# EasyEDA Pro project 成图电子类竞赛_嘉立创v2.epro

# Schematic 成图电子类竞赛

## Sheets
1 02-CPU
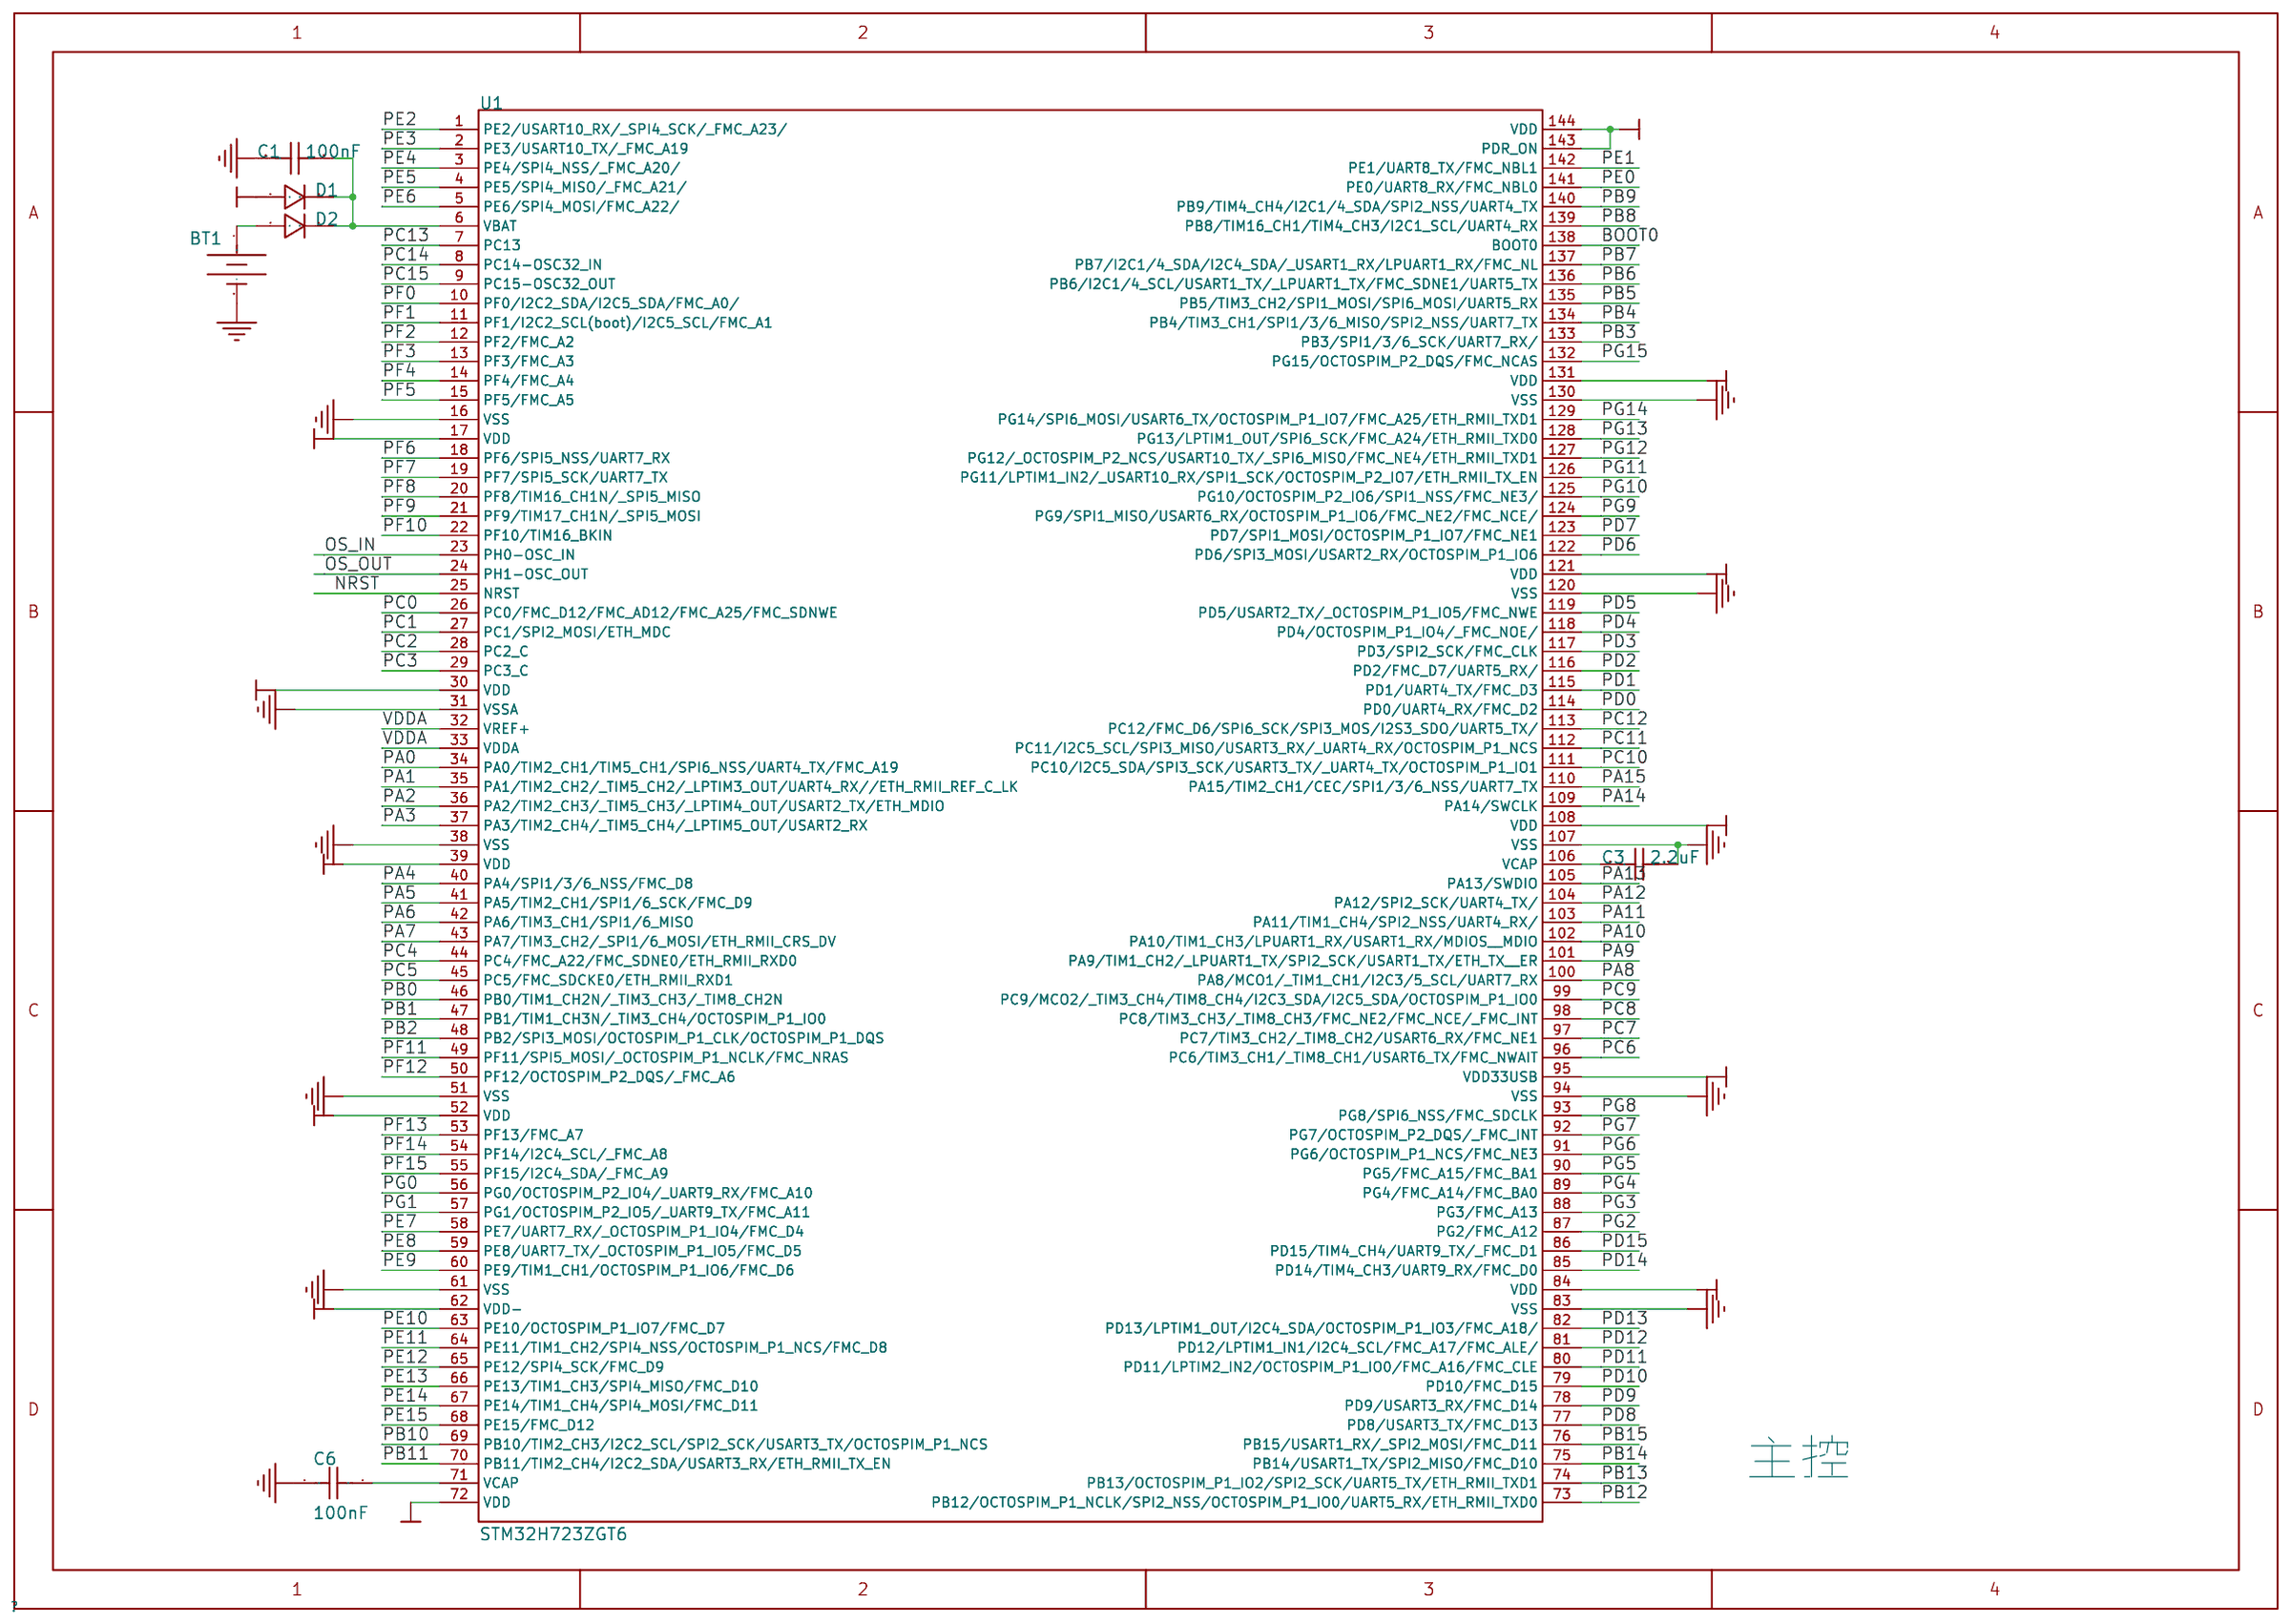
[diagram p0: 02-CPU]
2 04-USB-TFT
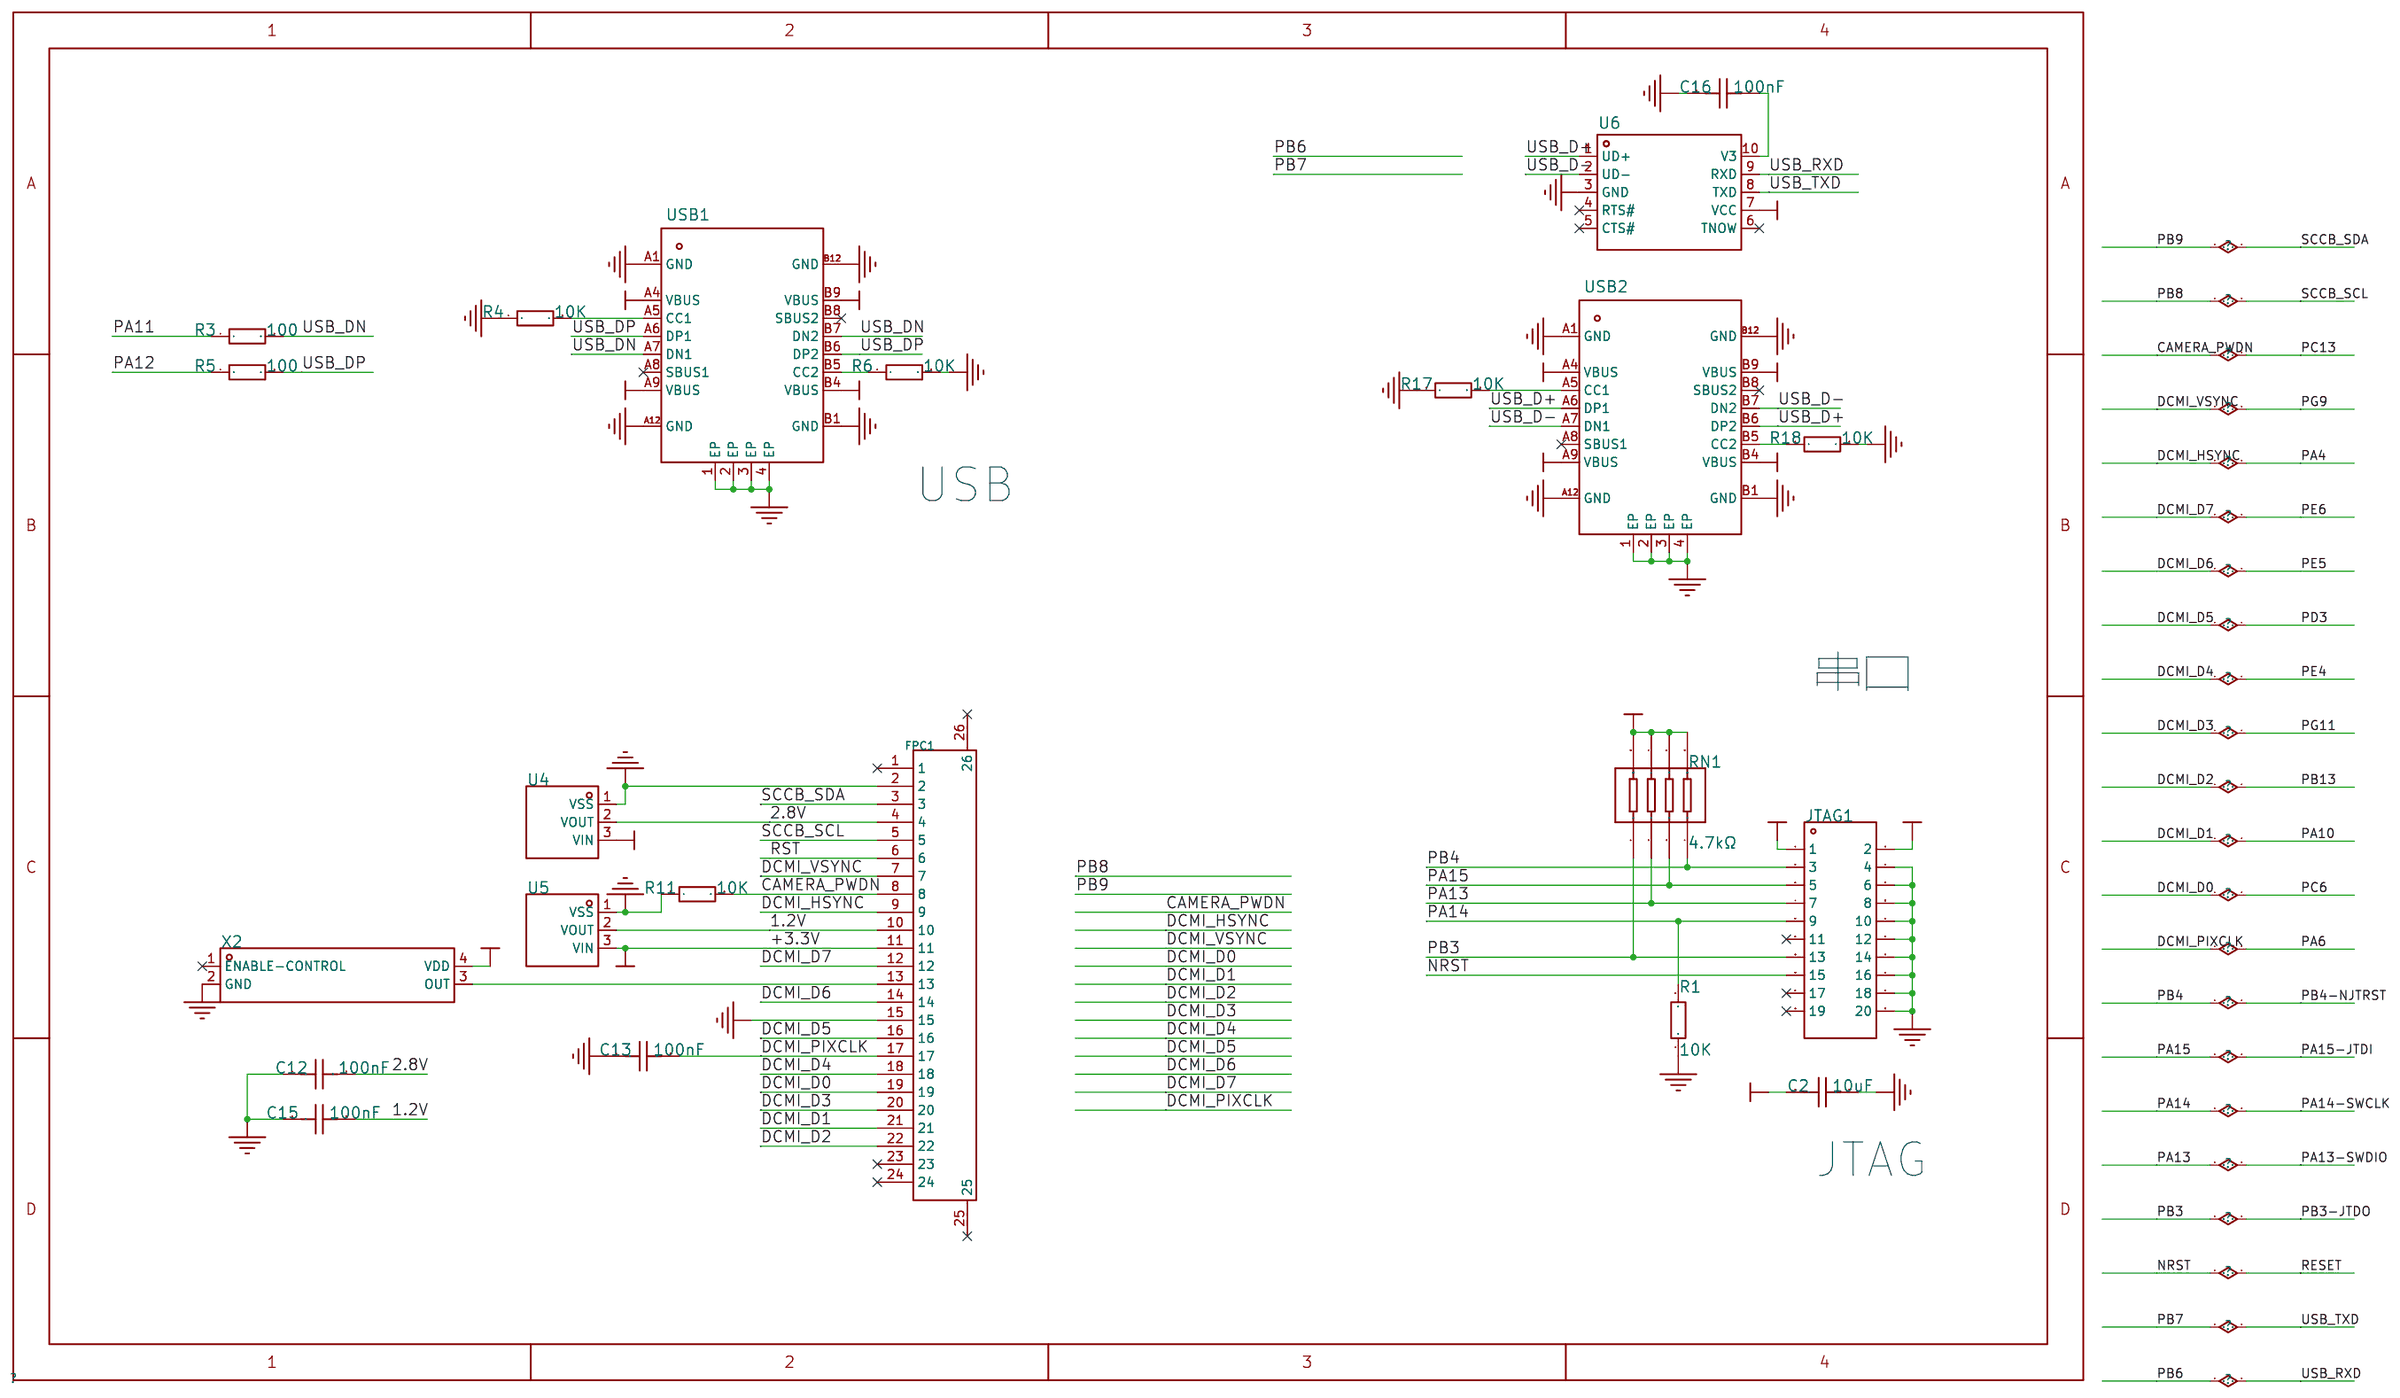
[diagram p1: 04-USB-TFT]
3 01-POWER
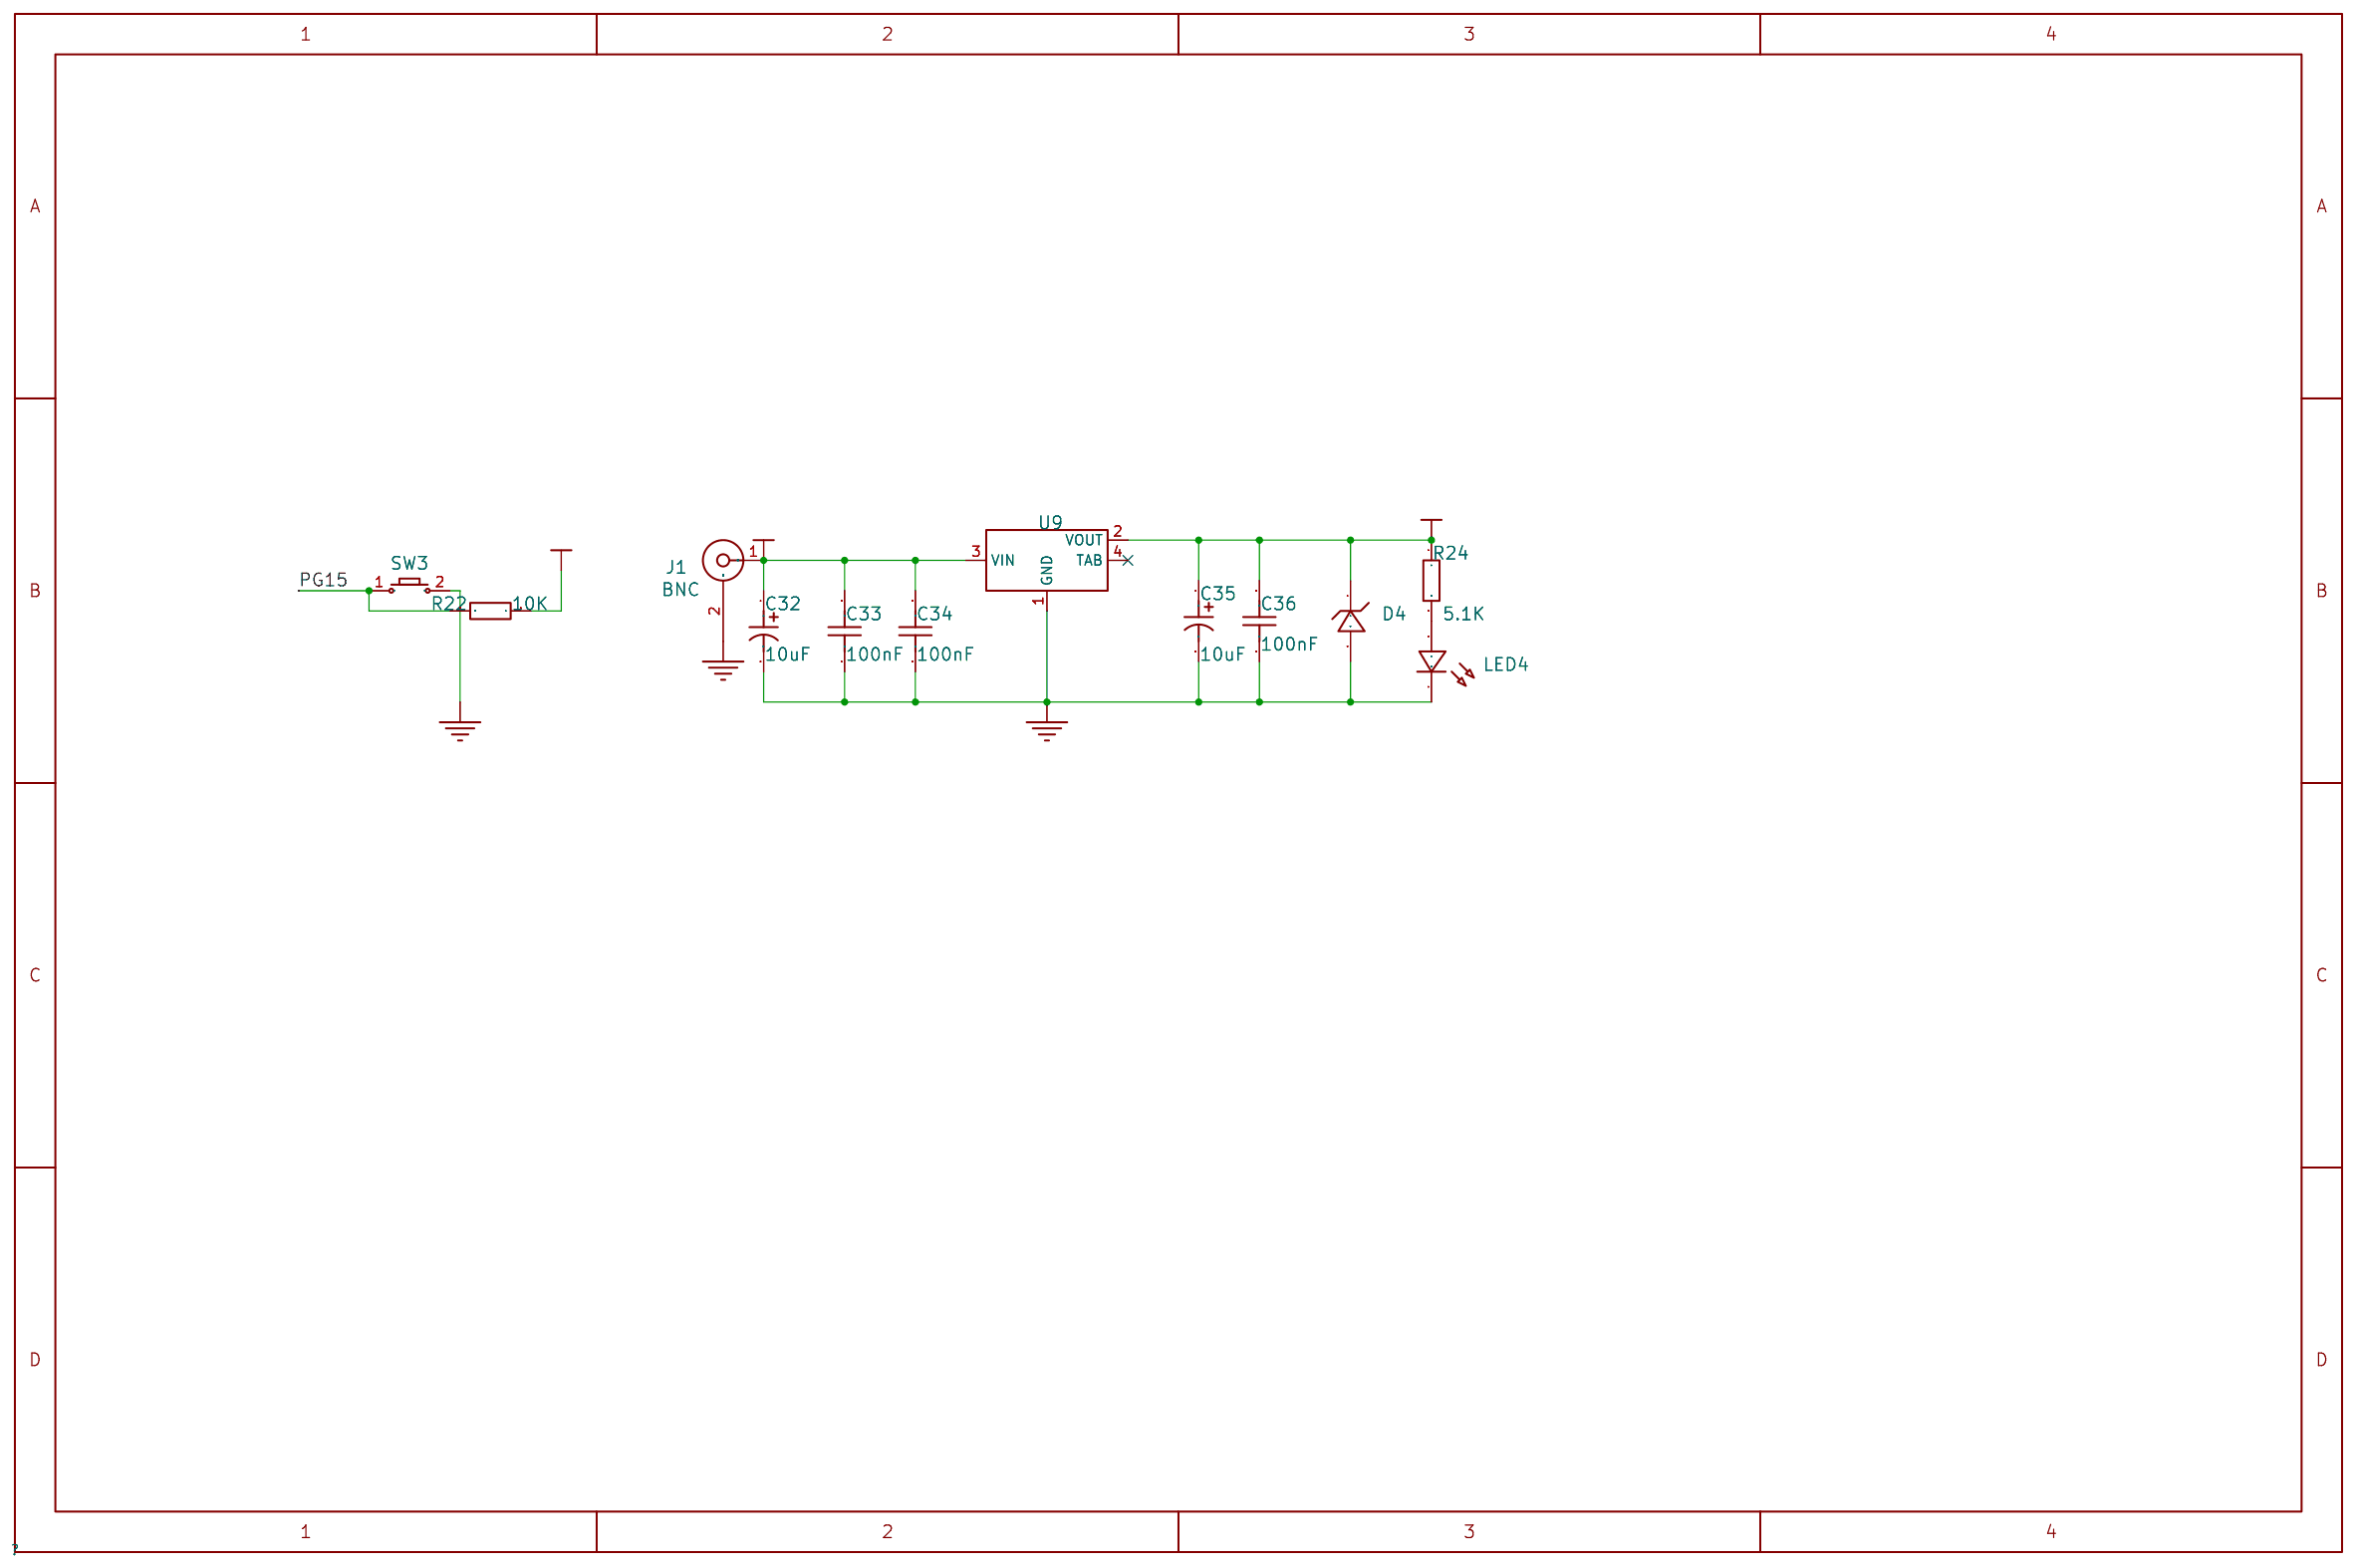
[diagram p2: 01-POWER]
4 03-SROM
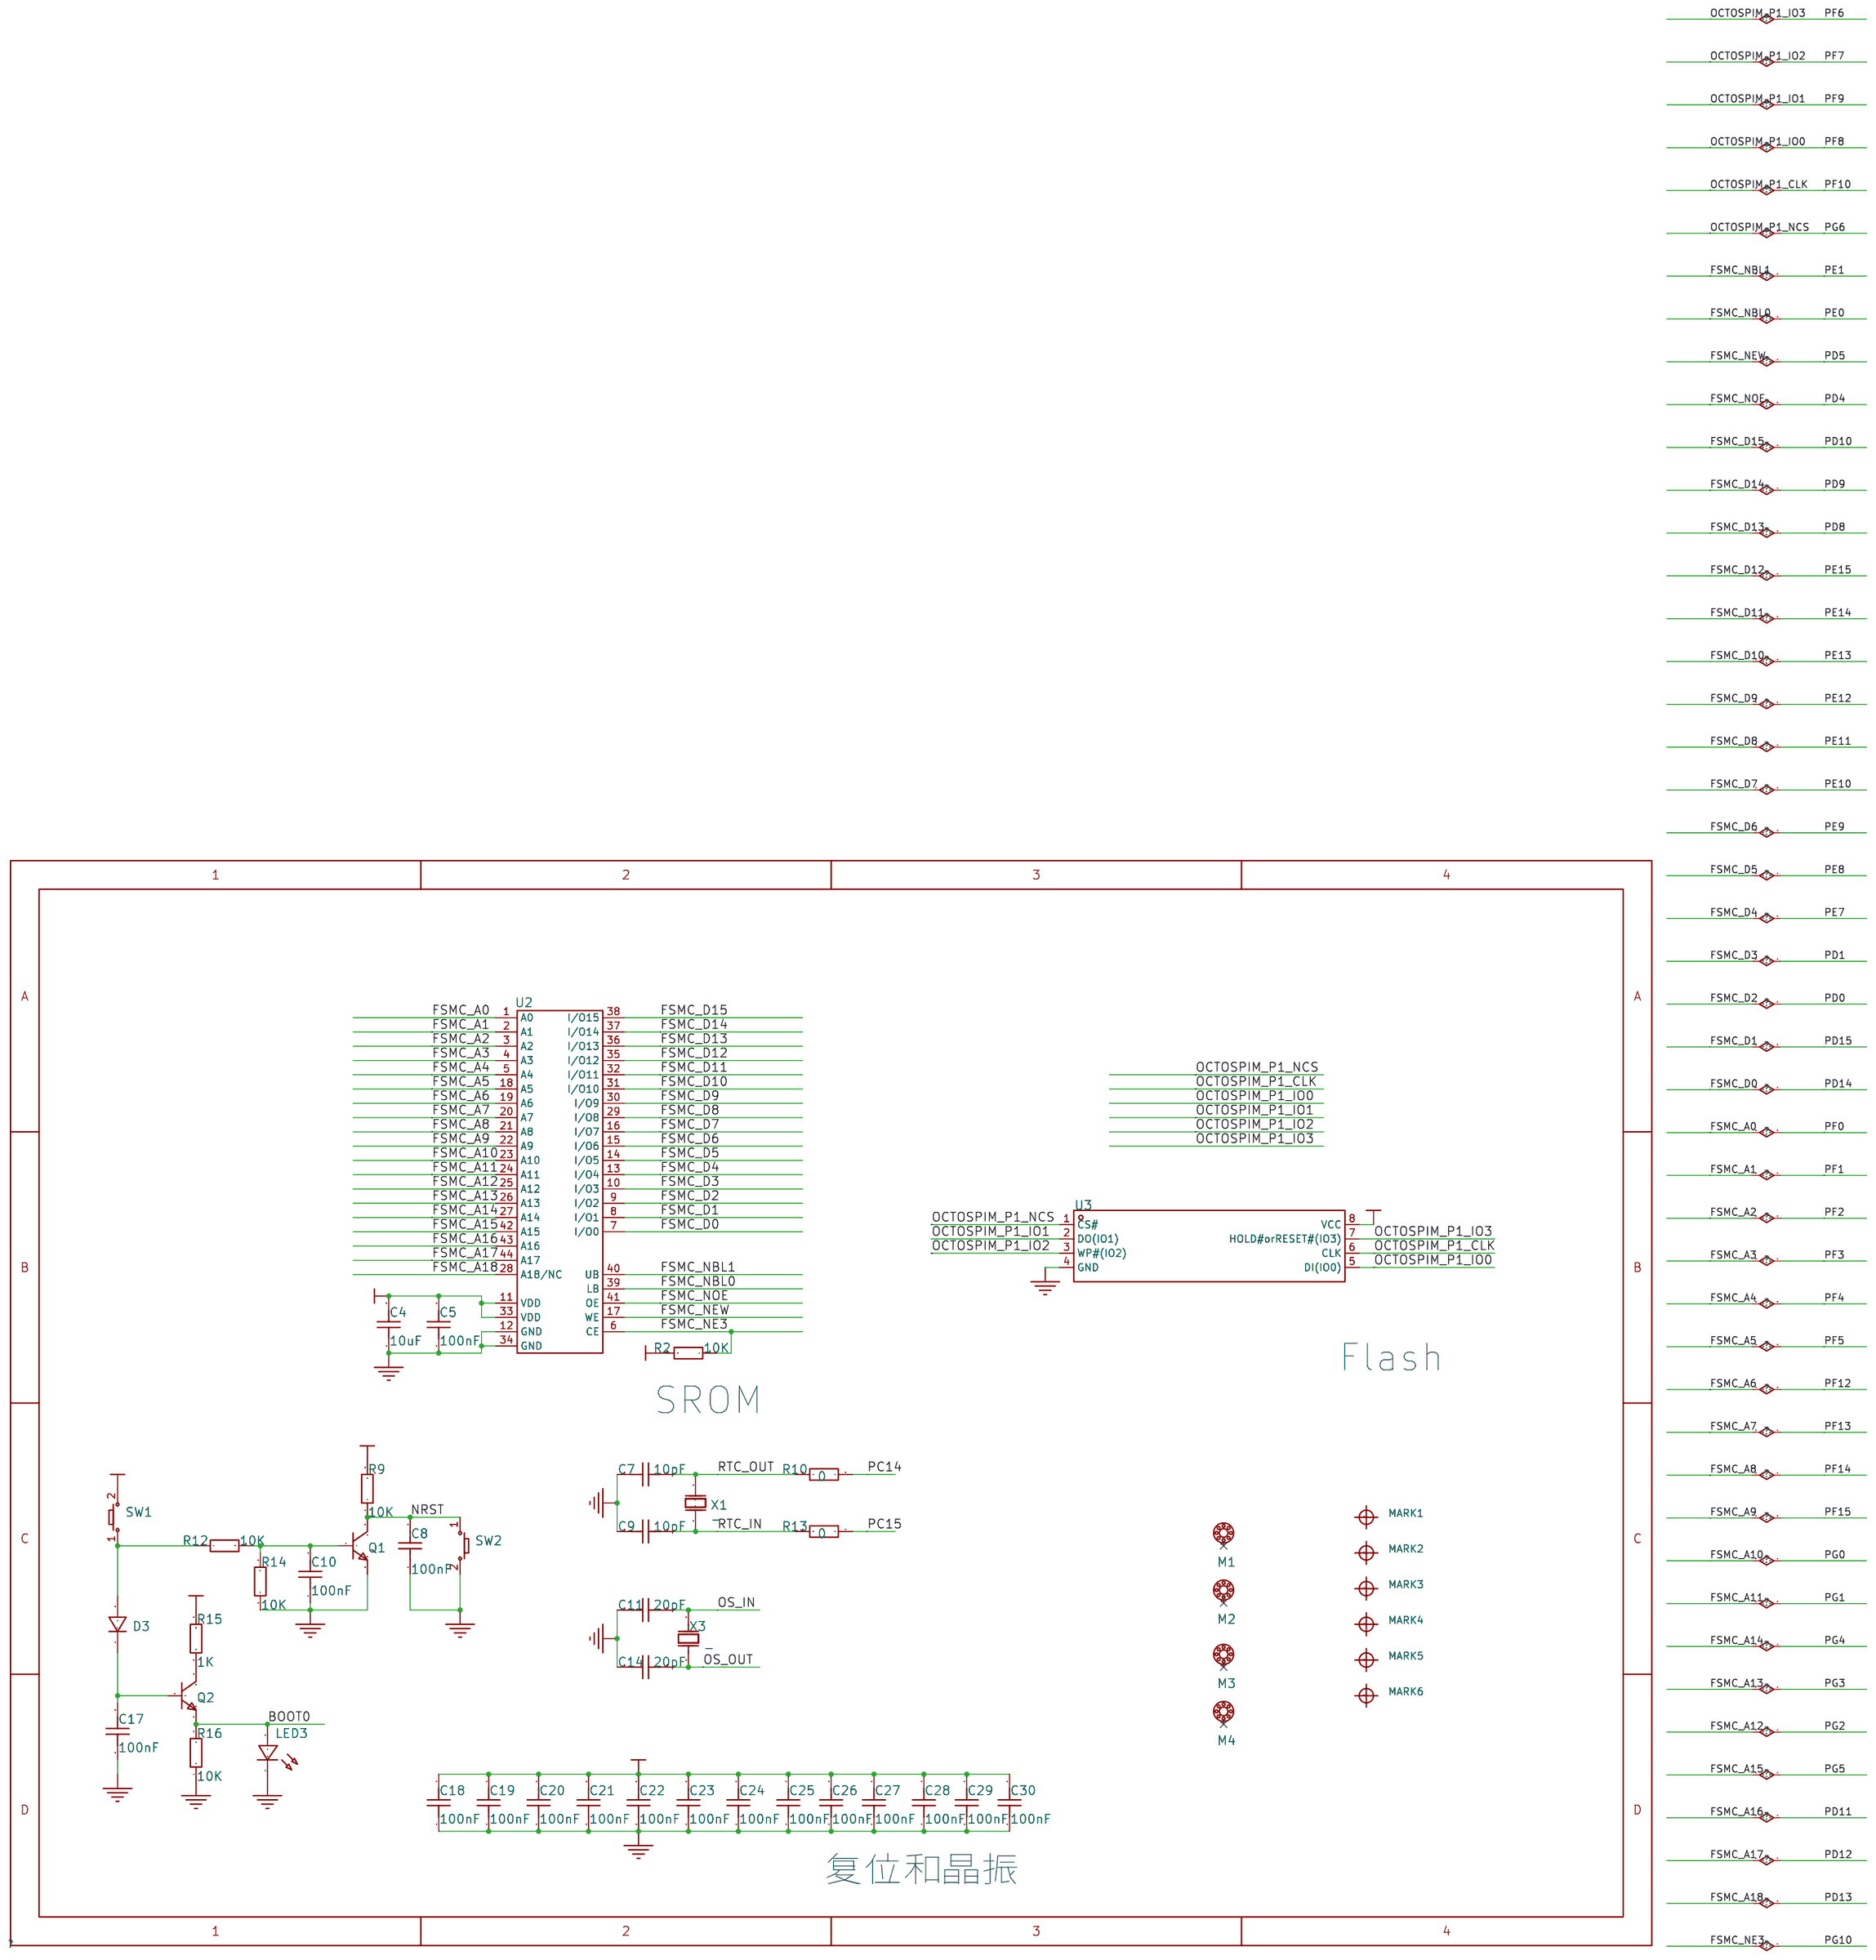
[diagram p3: 03-SROM]

## Parts
sheet 01-POWER
C32  10uF  [CAP-SMD_L3.5-W2.8]
C33  100nF  [C0603]
C34  100nF  [C0603]
C35  10uF  [CAP-SMD_L3.5-W2.8]
C36  100nF  [C0603]
D4  SMBJ3.3A_C362089  [SMB_L4.6-W3.6-LS5.3-RD]
J1  BNC  [DC-005B]
LED4  LED_0603-R  [LED_0603]
R22  10K  [R0603]
R24  5.1K  [R0603]
SW3  -  [Key_SMD_3.6x6.1x2.5]
U9  AMS1117  [SOT_223]
sheet 02-CPU
BT1  BS-12-B3AA003  [BAT-SMD_BS-12-B3AA011]
C1  100nF  [C0603]
C3  2.2uF  [C0603]
C6  100nF  [C0603]
D1  LL4148_C9808  [LL-34_L3.5-W1.5-RD]
D2  LL4148_C9808  [LL-34_L3.5-W1.5-RD]
U1  STM32H723ZGT6  [LQFP-144_20.0X20.0X0.5P]
sheet 03-SROM
C4  10uF  [C0603]
C5  100nF  [C0603]
C7  10pF  [C0603]
C8  100nF  [C0603]
C9  10pF  [C0603]
C10  100nF  [C0603]
C11  20pF  [C0603]
C14  20pF  [C0603]
C17  100nF  [C0603]
C18  100nF  [C0603]
C19  100nF  [C0603]
C20  100nF  [C0603]
C21  100nF  [C0603]
C22  100nF  [C0603]
C23  100nF  [C0603]
C24  100nF  [C0603]
C25  100nF  [C0603]
C26  100nF  [C0603]
C27  100nF  [C0603]
C28  100nF  [C0603]
C29  100nF  [C0603]
C30  100nF  [C0603]
D3  LL4148_C9808  [LL-34_L3.5-W1.5-RD]
LED3  LED_0603-R  [LED_0603]
M1  M3螺丝  [Screw]
M2  M3螺丝  [Screw]
M3  M3螺丝  [Screw]
M4  M3螺丝  [Screw]
MARK1  -  [Mark-Point-1mm]  (no BOM)
MARK2  -  [Mark-Point-1mm]  (no BOM)
MARK3  -  [Mark-Point-1mm]  (no BOM)
MARK4  -  [Mark-Point-1mm]  (no BOM)
MARK5  -  [Mark-Point-1mm]  (no BOM)
MARK6  -  [Mark-Point-1mm]  (no BOM)
Q1  S8050_SOT_NPN  [S8050_SOT-23]
Q2  S8050_SOT_NPN  [S8050_SOT-23]
R2  10K  [R0603]
R9  10K  [R0603]
R10  0  [R0402]
R12  10K  [R0603]
R13  0  [R0402]
R14  10K  [R0603]
R15  1K  [R0603]
R16  10K  [R0603]
SW1  -  [Key_SMD_3.6x6.1x2.5]
SW2  -  [Key_SMD_3.6x6.1x2.5]
U2  IS62WV51216  [TSOP-44]
U3  W25Q128JVSIQ_C113767  [SOIC-8_L5.3-W5.3-P1.27-LS8.0-BL]
X1  -  [OSC-TH_BD2.1-P0.70-D0.3]
X3  -  [HC-49S_L11.4-W4.8]
sheet 04-USB-TFT
C2  10uF  [C0603]
C12  100nF  [C0603]
C13  100nF  [C0603]
C15  100nF  [C0603]
C16  100nF  [C0603]
FPC1  AFC01-S24FCA-00  [FPC-SMD_P0.50-24P_FGS-XJ-H2.0]
JTAG1  IDC-20  [IDC-TH_20P-P2.54-V-R2-C10-S2.54]
R1  10K  [R0603]
R3  100  [R0603]
R4  10K  [R0603]
R5  100  [R0603]
R6  10K  [R0603]
R11  10K  [R0603]
R17  10K  [R0603]
R18  10K  [R0603]
RN1  4.7kΩ  [RES-ARRAY-SMD_0603-8P-L3.2-W1.6-BL]
U4  XC6206-2.8V  [SOT-23-3_L2.9-W1.6-P1.90-LS2.8-BR]
U5  XC6206P122MR-G  [SOT-23-3_L2.9-W1.6-P1.90-LS2.8-BR]
U6  CH340E  [MSOP-10_L3.0-W3.0-P0.50-LS5.0-BL]
USB1  USB_TYPE-C-16P  [USB_TYPE-C-16P]
USB2  USB_TYPE-C-16P  [USB_TYPE-C-16P]
X2  12M 有源晶振  [OSC-SMD_4P-L3.2-W2.5-BL]

## Library data of the parts
C32 C35 = CA45-B-16V-4.7μF-K: 容值:4.7uF;精度:±10%;额定电压:16V;等效串联电阻:3.5Ω@100kHz;; LCSC Part Name: 4.7uF ±10% 16V; Manufacturer: TORCH(火炬); Supplier Footprint: 1210; JLCPCB Part Class: Extended Part; Datasheet: https://atta.szlcsc.com/upload/public/pdf/source/20191009/C435293_78A410F3D73489DBEAC46056C4262F7A.pdf; Supplier: LCSC; Tolerance: ±10%; Rated Voltage: 16V; Equivalent Series Resistance(ESR): 3.5Ω@100kHz; Operating Temperature: -55℃~+125℃
C1-C30 C33 C34 C36 = CAP_0603: Supplier Footprint: 0603
D4 = SMBJ3.3A_C362089: 反向截止电压(Vrwm):3.3V;击穿电压:4.1V;最大钳位电压:7.3V;; LCSC Part Name: 单向TVS 3.3V截止 600W峰值脉冲功率; Supplier Part: C362089; Manufacturer: JKSEMI(金开盛); Manufacturer Part: SMBJ3.3A; Supplier Footprint: SMB(DO-214AA); JLCPCB Part Class: Extended Part; Datasheet: https://atta.szlcsc.com/upload/public/pdf/source/20200731/C362089_3B984BF84356FE4A5051ADB3F5B1E766.pdf; Supplier: LCSC; Unidirectional Channels: 1; Bidirectional Channels: 0; Reverse Stand-Off Voltage (Vrwm): 3.3V; Breakdown Voltage: 4.1V; Maximum Clamping Voltage: 7.3V; Peak Pulse Power Dissipation (Ppp)@10/1000us: 600W
J1 = BNC: PCB DECAL: RCA-101; SOURCE_PATH: C:\PROGRAM FILES\印院出品\CAPTURE 16.2\LIBRARY\CONNECTOR.OLB; LibraryName: VIDEO_Demo_Kit_1
LED3 LED4 = LED_0603: Supplier Footprint: 0603
R2-R6 R11 R12 R17 R18 R22 = Res_0603_1: Supplier Footprint: 0603; DesignItemID: Res_0603
R1 R9 R14-R16 R24 = Res_0603: Supplier Footprint: 0603
SW3 = Key_SMD_3.6x6.1x2.5: Supplier Footprint: SMD
U9 = AMS1117
BT1 = BS-12-B3AA003: 连接器类型:电池底座;适用电池规格:CR1220;工作温度范围:-25℃~+85℃;; Supplier: LCSC; Supplier Part: C964723; Manufacturer: MYOUNG(美阳); JLCPCB Part Class: 扩展库; LCSC Part Name: 电池底座 适用电池:CR1220; Supplier Footprint: SMD; Datasheet: https://atta.szlcsc.com/upload/public/pdf/source/20201218/C964723_733B638E287393F86295A2A4DAE43C75.pdf; Connector Type: 电池底座; Battery Type: CR1220; Operating Temperature Range: -25℃~+85℃
D1-D3 = LL4148_C9808: 二极管配置:-;功率:500mW;直流反向耐压(Vr):75V;平均整流电流(Io):200mA;正向压降(Vf):1V@10mA;反向电流(Ir):5uA@75V;反向恢复时间(trr):4ns;工作温度:+175℃@(Tj);; LCSC Part Name: 75V 200mA 4ns; Supplier Part: C9808; Manufacturer: ST(先科); Manufacturer Part: LL4148; Supplier Footprint: LL-34; JLCPCB Part Class: Basic Part; Datasheet: https://atta.szlcsc.com/upload/public/pdf/source/20121108/1457706554347.pdf; Supplier: LCSC; Power Dissipation: 500mW; Reverse Voltage (Vr): 75V; Average Rectified Current (Io): 200mA; Forward Voltage (Vf@If): 1V@10mA; Reverse Leakage Current: 5uA@75V; Reverse Recovery Time (trr): 4ns; Operating Temperature: +175℃@(Tj)
U1 = STM32H723ZGT6: ARM-M系列 CPU最大主频：550MHz 程序存储容量：1MB 程序存储器类型：FLASH RAM总容量：564KB GPIO端口数量：80
M1-M4 = M3螺丝: Pin Type: IN
MARK1-MARK6 = Mark-Point: Mark点
Q1 Q2 = S8050_SOT_NPN: Supplier Footprint: SOT-23
R10 R13 = Res_0402: Supplier Footprint: 0402
SW1 SW2 = Key_SMD_3.6x6.1x2.5_1: Supplier Footprint: SMD
U2 = IS62WV51216: Pin Type: IN
U3 = W25Q128JVSIQ_C113767: LCSC Part Name: W25Q128JVSIQ; Supplier Part: C113767; Manufacturer: WINBOND(华邦); Manufacturer Part: W25Q128JVSIQ; Supplier Footprint: SOIC-8-208mil; JLCPCB Part Class: 扩展库; Datasheet: https://atta.szlcsc.com/upload/public/pdf/source/20180329/C113767_097B64D788F6E3FFB2E9CB46CB6C1427.pdf; Supplier: LCSC
X1 = 1TD125BFNS001: 频率:-;负载电容:-;; LCSC Part Name: DT-26 32.768K 10PPM 12.5PF 袋装/盒装 袋装/盒装; Supplier Part: C213419; Manufacturer: KDS(大真空); Supplier Footprint: DT-26; JLCPCB Part Class: 扩展库; Datasheet: https://atta.szlcsc.com/upload/public/pdf/source/20180530/C213419_C8E01C2F1F46F9420141CAE391D7F4A5.pdf; Supplier: LCSC
X3 = 9C08000003: 频率:-;负载电容:-;; LCSC Part Name: HC-49SMD 8M 20pF 20ppm; Supplier Part: C90937; Manufacturer: TXC(晶技); Supplier Footprint: HC-49S-SMD; JLCPCB Part Class: Extended Part; Datasheet: https://atta.szlcsc.com/upload/public/pdf/source/20161217/1481939207740.pdf; Supplier: LCSC
FPC1 = AFC01-S24FCA-00: 间距:0.5mm;触点数量:24P;锁定特性:翻盖式;安装类型:卧贴;触点类型:下接;; Supplier: LCSC; Supplier Part: C262669; Manufacturer: JS(钜硕电子); JLCPCB Part Class: 扩展库; LCSC Part Name: 0.5mm P数:24P 翻盖式 下接; Supplier Footprint: SMD,P=0.5mm; Datasheet: https://atta.szlcsc.com/upload/public/pdf/source/20190816/C413942_2A72D1AC756EAE17EEDF756A339D4500.pdf; Pitch: 0.5mm; Number of Contacts: 24P; Locking Feature: 翻盖式; Mounting Type: 卧贴; Contact Type: 下接; Height Above Board: 2mm; FFC, FCB Thickness: 0.3mm
JTAG1 = IDC-20: Supplier Part: C9900015890; Supplier Footprint: JTAG; JLCPCB Part Class: ExtendedPart; Datasheet: https://atta.szlcsc.comnull; Supplier: LCSC
RN1 = 4D03WGJ0472T5E: 阻值:4.7kΩ;精度:±5%;单个元件功率:62.5mW;电阻器数:4;温度系数:±200ppm/℃;; Supplier: LCSC; Manufacturer: UNI-ROYAL(厚声); Supplier Part: C1980; JLCPCB Part Class: 基础库; LCSC Part Name: 4.7kΩ ±5%; Supplier Footprint: 0603x4; Datasheet: https://atta.szlcsc.com/upload/public/pdf/source/20191224/C474318_2527498AE30E813171187CCD28401A71.pdf; Tolerance: ±5%; Power(Watts): 62.5mW; Number of Resistors: 4; Number of Pins: 8; Temperature Coefficient: ±200ppm/℃
U4 = XC6206-2.8V: 输出类型:固定;输出极性:正;最大输入电压:6V;输出电压:2.8V;输出电流:250mA;; Supplier Part: C2892669; Manufacturer: YONGYUTAI(永裕泰); Supplier Footprint: SOT-23-3L; JLCPCB Part Class: 扩展库; Datasheet: https://atta.szlcsc.com/upload/public/pdf/source/20210901/DE3C77F0CE73FFE8F7C655BE9B94CB06.pdf; Supplier: LCSC; Output Type: 固定; Output Polarity: 正; Number of Outputs: 1; Maximum Input Voltage: 6V; Output Voltage: 2.8V; Output Current: 250mA; Operating Temperature: -40℃~+85℃@(Tj)
U5 = XC6206P122MR-G: 输出类型:固定;输出极性:正;最大输入电压:7V;输出电压:1.2V~1.2V;输出电流:60mA;电源纹波抑制比(PSRR):-;; Supplier Part: C424699; Manufacturer: TOREX(特瑞仕); Supplier Footprint: SOT-23; JLCPCB Part Class: 扩展库; Datasheet: https://atta.szlcsc.com/upload/public/pdf/source/20190903/C424699_59FCC169C113A8B3272904318A708AFC.pdf; Supplier: LCSC; Output Type: 固定; Output Polarity: 正; Number of Outputs: 1; Maximum Input Voltage: 7V; Output Voltage: 1.2V~1.2V; Dropout Voltage: 960mV@(60mA); Output Current: 60mA
U6 = CH340E: 应用功能:收发器;接口协议:USB 2.0;数据速率:2Mbps;; Supplier: LCSC; Manufacturer: WCH(南京沁恒); Supplier Part: C99652; JLCPCB Part Class: 扩展库; LCSC Part Name: USB转串口芯片 CH340; Supplier Footprint: MSOP-10; Datasheet: https://atta.szlcsc.com/upload/public/pdf/source/20230530/6E401E9554E9F5311886CC8B3F89B62E.pdf; Applications Function: 收发器; Protocol: USB 2.0; Data Rate: 2Mbps; Supply Voltage: 3.3V；5V
USB1 USB2 = USB_TYPE-C-16P: Supplier Footprint: SMD
X2 = 12M 有源晶振: Supplier Part: C9900018362; Supplier Footprint: SMD3225; JLCPCB Part Class: 扩展库; Datasheet: https://atta.szlcsc.comnull; Supplier: LCSC

## Nets
1.2V: C15.2 FPC1.10 U5.2(VOUT)
2.8V: C12.2 FPC1.4 U4.2(VOUT)
+3.3V: C2.1 C4.2 C5.2 C18.2 C19.2 C20.2 C21.2 C22.2 C23.2 C24.2 C25.2 C26.2 C27.2 C28.2 C29.2 C30.2 C35.1 C36.2 D1.2(A) D4.1 FPC1.11 JTAG1.1 JTAG1.2 R2.2 R9.2 R15.2 R22.1 R24.1 RN1.5 RN1.6 RN1.7 RN1.8 SW1.2 U1.17(VDD) U1.30(VDD) U1.39(VDD) U1.52(VDD) U1.62(VDD-) U1.72(VDD) U1.84(VDD) U1.95(VDD33USB) U1.108(VDD) U1.121(VDD) U1.131(VDD) U1.143(PDR_ON) U1.144(VDD) U2.11(VDD) U2.33(VDD) U3.8(VCC) U4.3(VIN) U5.3(VIN) U9.2(VOUT) X2.4(VDD)
+5V: C32.1 C33.2 C34.2 J1.1(CENTER) U6.7(VCC) U9.3(VIN) USB1.A4(VBUS) USB1.A9(VBUS) USB1.B4(VBUS) USB1.B9(VBUS) USB2.A4(VBUS) USB2.A9(VBUS) USB2.B4(VBUS) USB2.B9(VBUS)
GND: BT1.2(-) C1.2 C2.2 C3.1 C4.1 C5.1 C6.1 C7.1 C8.1 C9.1 C10.1 C11.1 C12.1 C13.1 C14.1 C15.1 C16.2 C17.1 C18.1 C19.1 C20.1 C21.1 C22.1 C23.1 C24.1 C25.1 C26.1 C27.1 C28.1 C29.1 C30.1 C32.2 C33.1 C34.1 C35.2 C36.1 D4.2 FPC1.2 FPC1.15 J1.2(SHIELD) JTAG1.4 JTAG1.6 JTAG1.8 JTAG1.10 JTAG1.12 JTAG1.14 JTAG1.16 JTAG1.18 JTAG1.20 LED3.1(C) LED4.1(C) Q1.2 R1.1 R4.1 R6.2 R11.1 R14.1 R16.1 R17.1 R18.2 SW2.2 SW3.2 U1.16(VSS) U1.31(VSSA) U1.38(VSS) U1.51(VSS) U1.61(VSS) U1.83(VSS) U1.94(VSS) U1.107(VSS) U1.120(VSS) U1.130(VSS) U2.12(GND) U2.34(GND) U3.4(GND) U4.1(VSS) U5.1(VSS) U6.3(GND) U9.1(GND) USB1.1(EP) USB1.2(EP) USB1.3(EP) USB1.4(EP) USB1.A1(GND) USB1.A12(GND) USB1.B1(GND) USB1.B12(GND) USB2.1(EP) USB2.2(EP) USB2.3(EP) USB2.4(EP) USB2.A1(GND) USB2.A12(GND) USB2.B1(GND) USB2.B12(GND) X2.2(GND)
VDDA: U1.32(VREF+) U1.33(VDDA)
BOOT0: LED3.2(A) Q2.2 R16.2 U1.138(BOOT0)
CAMERA_PWDN: FPC1.8 R11.2 U1.7(PC13)
DCMI_D0: FPC1.19 U1.96(PC6/TIM3_CH1/ TIM8_CH1/USART6_TX/FMC_NWAIT)
DCMI_D1: FPC1.21 U1.102(PA10/TIM1_CH3/LPUART1_RX/USART1_RX/MDIOS_ MDIO)
DCMI_D2: FPC1.22 U1.74(PB13/OCTOSPIM_P1_IO2/SPI2_SCK/UART5_TX/ETH_RMII_TXD1)
DCMI_D3: FPC1.20 U1.126(PG11/LPTIM1_IN2/ USART10_RX/SPI1_SCK/OCTOSPIM_P2_IO7/ETH_RMII_TX_EN)
DCMI_D4: FPC1.18 U1.3(PE4/SPI4_NSS/ FMC_A20/)
DCMI_D5: FPC1.16 U1.117(PD3/SPI2_SCK/FMC_CLK)
DCMI_D6: FPC1.14 U1.4(PE5/SPI4_MISO/ FMC_A21/)
DCMI_D7: FPC1.12 U1.5(PE6/SPI4_MOSI/FMC_A22/)
DCMI_HSYNC: FPC1.9 U1.40(PA4/SPI1/3/6_NSS/FMC_D8)
DCMI_PIXCLK: C13.2 FPC1.17 U1.42(PA6/TIM3_CH1/SPI1/6_MISO)
DCMI_VSYNC: FPC1.7 U1.124(PG9/SPI1_MISO/USART6_RX/OCTOSPIM_P1_IO6/FMC_NE2/FMC_NCE/)
FSMC_A0: U1.10(PF0/I2C2_SDA/I2C5_SDA/FMC_A0/) U2.1(A0)
FSMC_A1: U1.11(PF1/I2C2_SCL(boot)/I2C5_SCL/FMC_A1) U2.2(A1)
FSMC_A2: U1.12(PF2/FMC_A2) U2.3(A2)
FSMC_A3: U1.13(PF3/FMC_A3) U2.4(A3)
FSMC_A4: U1.14(PF4/FMC_A4) U2.5(A4)
FSMC_A5: U1.15(PF5/FMC_A5) U2.18(A5)
FSMC_A6: U1.50(PF12/OCTOSPIM_P2_DQS/ FMC_A6) U2.19(A6)
FSMC_A7: U1.53(PF13/FMC_A7) U2.20(A7)
FSMC_A8: U1.54(PF14/I2C4_SCL/ FMC_A8) U2.21(A8)
FSMC_A9: U1.55(PF15/I2C4_SDA/ FMC_A9) U2.22(A9)
FSMC_A10: U1.56(PG0/OCTOSPIM_P2_IO4/ UART9_RX/FMC_A10) U2.23(A10)
FSMC_A11: U1.57(PG1/OCTOSPIM_P2_IO5/ UART9_TX/FMC_A11) U2.24(A11)
FSMC_A12: U1.87(PG2/FMC_A12) U2.25(A12)
FSMC_A13: U1.88(PG3/FMC_A13) U2.26(A13)
FSMC_A14: U1.89(PG4/FMC_A14/FMC_BA0) U2.27(A14)
FSMC_A15: U1.90(PG5/FMC_A15/FMC_BA1) U2.42(A15)
FSMC_A16: U1.80(PD11/LPTIM2_IN2/OCTOSPIM_P1_IO0/FMC_A16/FMC_CLE) U2.43(A16)
FSMC_A17: U1.81(PD12/LPTIM1_IN1/I2C4_SCL/FMC_A17/FMC_ALE/) U2.44(A17)
FSMC_A18: U1.82(PD13/LPTIM1_OUT/I2C4_SDA/OCTOSPIM_P1_IO3/FMC_A18/) U2.28(A18/NC)
FSMC_D0: U1.85(PD14/TIM4_CH3/UART9_RX/FMC_D0) U2.7(I/O0)
FSMC_D1: U1.86(PD15/TIM4_CH4/UART9_TX/ FMC_D1) U2.8(I/O1)
FSMC_D2: U1.114(PD0/UART4_RX/FMC_D2) U2.9(I/O2)
FSMC_D3: U1.115(PD1/UART4_TX/FMC_D3) U2.10(I/O3)
FSMC_D4: U1.58(PE7/UART7_RX/ OCTOSPIM_P1_IO4/FMC_D4) U2.13(I/O4)
FSMC_D5: U1.59(PE8/UART7_TX/ OCTOSPIM_P1_IO5/FMC_D5) U2.14(I/O5)
FSMC_D6: U1.60(PE9/TIM1_CH1/OCTOSPIM_P1_IO6/FMC_D6) U2.15(I/O6)
FSMC_D7: U1.63(PE10/OCTOSPIM_P1_IO7/FMC_D7) U2.16(I/O7)
FSMC_D8: U1.64(PE11/TIM1_CH2/SPI4_NSS/OCTOSPIM_P1_NCS/FMC_D8) U2.29(I/O8)
FSMC_D9: U1.65(PE12/SPI4_SCK/FMC_D9) U2.30(I/O9)
FSMC_D10: U1.66(PE13/TIM1_CH3/SPI4_MISO/FMC_D10) U2.31(I/O10)
FSMC_D11: U1.67(PE14/TIM1_CH4/SPI4_MOSI/FMC_D11) U2.32(I/O11)
FSMC_D12: U1.68(PE15/FMC_D12) U2.35(I/O12)
FSMC_D13: U1.77(PD8/USART3_TX/FMC_D13) U2.36(I/O13)
FSMC_D14: U1.78(PD9/USART3_RX/FMC_D14) U2.37(I/O14)
FSMC_D15: U1.79(PD10/FMC_D15) U2.38(I/O15)
FSMC_NBL0: U1.141(PE0/UART8_RX/FMC_NBL0) U2.39(LB)
FSMC_NBL1: U1.142(PE1/UART8_TX/FMC_NBL1) U2.40(UB)
FSMC_NE3: R2.1 U1.125(PG10/OCTOSPIM_P2_IO6/SPI1_NSS/FMC_NE3/) U2.6(CE)
FSMC_NEW: U1.119(PD5/USART2_TX/ OCTOSPIM_P1_IO5/FMC_NWE) U2.17(WE)
FSMC_NOE: U1.118(PD4/OCTOSPIM_P1_IO4/ FMC_NOE/) U2.41(OE)
NRST: C8.2 JTAG1.15 Q1.3 R9.1 SW2.1 U1.25(NRST)
OCTOSPIM_P1_CLK: U1.22(PF10/TIM16_BKIN) U3.6(CLK)
OCTOSPIM_P1_IO0: U1.20(PF8/TIM16_CH1N/ SPI5_MISO) U3.5(DI(IO0))
OCTOSPIM_P1_IO1: U1.21(PF9/TIM17_CH1N/ SPI5_MOSI) U3.2(DO(IO1))
OCTOSPIM_P1_IO2: U1.19(PF7/SPI5_SCK/UART7_TX) U3.3(WP#(IO2))
OCTOSPIM_P1_IO3: U1.18(PF6/SPI5_NSS/UART7_RX) U3.7(HOLD#orRESET#(IO3))
OCTOSPIM_P1_NCS: U1.91(PG6/OCTOSPIM_P1_NCS/FMC_NE3) U3.1(CS#)
OS_IN: C11.2 U1.23(PH0-OSC_IN) X3.2(OSC2)
OS_OUT: C14.2 U1.24(PH1-OSC_OUT) X3.1(OSC1)
PA0: U1.34(PA0/TIM2_CH1/TIM5_CH1/SPI6_NSS/UART4_TX/FMC_A19)
PA1: U1.35(PA1/TIM2_CH2/ TIM5_CH2/ LPTIM3_OUT/UART4_RX//ETH_RMII_REF_C LK)
PA2: U1.36(PA2/TIM2_CH3/ TIM5_CH3/ LPTIM4_OUT/USART2_TX/ETH_MDIO)
PA3: U1.37(PA3/TIM2_CH4/ TIM5_CH4/ LPTIM5_OUT/USART2_RX)
PA5: U1.41(PA5/TIM2_CH1/SPI1/6_SCK/FMC_D9)
PA7: U1.43(PA7/TIM3_CH2/ SPI1/6_MOSI/ETH_RMII_CRS_DV)
PA8: U1.100(PA8/MCO1/ TIM1_CH1/I2C3/5_SCL/UART7_RX)
PA9: U1.101(PA9/TIM1_CH2/ LPUART1_TX/SPI2_SCK/USART1_TX/ETH_TX_ ER)
PA11: R3.1 U1.103(PA11/TIM1_CH4/SPI2_NSS/UART4_RX/)
PA12: R5.1 U1.104(PA12/SPI2_SCK/UART4_TX/)
PA13: JTAG1.7 RN1.2 U1.105(PA13/SWDIO)
PA14: JTAG1.9 R1.2 U1.109(PA14/SWCLK)
PA15: JTAG1.5 RN1.3 U1.110(PA15/TIM2_CH1/CEC/SPI1/3/6_NSS/UART7_TX)
PB0: U1.46(PB0/TIM1_CH2N/ TIM3_CH3/ TIM8_CH2N)
PB1: U1.47(PB1/TIM1_CH3N/ TIM3_CH4/OCTOSPIM_P1_IO0)
PB2: U1.48(PB2/SPI3_MOSI/OCTOSPIM_P1_CLK/OCTOSPIM_P1_DQS)
PB3: JTAG1.13 RN1.1 U1.133(PB3/SPI1/3/6_SCK/UART7_RX/)
PB4: JTAG1.3 RN1.4 U1.134(PB4/TIM3_CH1/SPI1/3/6_MISO/SPI2_NSS/UART7_TX)
PB5: U1.135(PB5/TIM3_CH2/SPI1_MOSI/SPI6_MOSI/UART5_RX)
PB6: U1.136(PB6/I2C1/4_SCL/USART1_TX/ LPUART1_TX/FMC_SDNE1/UART5_TX) U6.9(RXD)
PB7: U1.137(PB7/I2C1/4_SDA/I2C4_SDA/ USART1_RX/LPUART1_RX/FMC_NL) U6.8(TXD)
PB8: FPC1.5 U1.139(PB8/TIM16_CH1/TIM4_CH3/I2C1_SCL/UART4_RX)
PB9: FPC1.3 U1.140(PB9/TIM4_CH4/I2C1/4_SDA/SPI2_NSS/UART4_TX)
PB10: U1.69(PB10/TIM2_CH3/I2C2_SCL/SPI2_SCK/USART3_TX/OCTOSPIM_P1_NCS)
PB11: U1.70(PB11/TIM2_CH4/I2C2_SDA/USART3_RX/ETH_RMII_TX_EN)
PB12: U1.73(PB12/OCTOSPIM_P1_NCLK/SPI2_NSS/OCTOSPIM_P1_IO0/UART5_RX/ETH_RMII_TXD0)
PB14: U1.75(PB14/USART1_TX/SPI2_MISO/FMC_D10)
PB15: U1.76(PB15/USART1_RX/ SPI2_MOSI/FMC_D11)
PC0: U1.26(PC0/FMC_D12/FMC_AD12/FMC_A25/FMC_SDNWE)
PC1: U1.27(PC1/SPI2_MOSI/ETH_MDC)
PC2: U1.28(PC2_C)
PC3: U1.29(PC3_C)
PC4: U1.44(PC4/FMC_A22/FMC_SDNE0/ETH_RMII_RXD0)
PC5: U1.45(PC5/FMC_SDCKE0/ETH_RMII_RXD1)
PC7: U1.97(PC7/TIM3_CH2/ TIM8_CH2/USART6_RX/FMC_NE1)
PC8: U1.98(PC8/TIM3_CH3/ TIM8_CH3/FMC_NE2/FMC_NCE/ FMC_INT)
PC9: U1.99(PC9/MCO2/ TIM3_CH4/TIM8_CH4/I2C3_SDA/I2C5_SDA/OCTOSPIM_P1_IO0)
PC10: U1.111(PC10/I2C5_SDA/SPI3_SCK/USART3_TX/ UART4_TX/OCTOSPIM_P1_IO1)
PC11: U1.112(PC11/I2C5_SCL/SPI3_MISO/USART3_RX/ UART4_RX/OCTOSPIM_P1_NCS)
PC12: U1.113(PC12/FMC_D6/SPI6_SCK/SPI3_MOS/I2S3_SDO/UART5_TX/)
PC14: R10.2 U1.8(PC14-OSC32_IN)
PC15: R13.2 U1.9(PC15-OSC32_OUT)
PD2: U1.116(PD2/FMC_D7/UART5_RX/)
PD6: U1.122(PD6/SPI3_MOSI/USART2_RX/OCTOSPIM_P1_IO6)
PD7: U1.123(PD7/SPI1_MOSI/OCTOSPIM_P1_IO7/FMC_NE1)
PE2: U1.1(PE2/USART10_RX/ SPI4_SCK/ FMC_A23/)
PE3: U1.2(PE3/USART10_TX/ FMC_A19)
PF11: U1.49(PF11/SPI5_MOSI/ OCTOSPIM_P1_NCLK/FMC_NRAS)
PG7: U1.92(PG7/OCTOSPIM_P2_DQS/ FMC_INT)
PG8: U1.93(PG8/SPI6_NSS/FMC_SDCLK)
PG12: U1.127(PG12/ OCTOSPIM_P2_NCS/USART10_TX/ SPI6_MISO/FMC_NE4/ETH_RMII_TXD1)
PG13: U1.128(PG13/LPTIM1_OUT/SPI6_SCK/FMC_A24/ETH_RMII_TXD0)
PG14: U1.129(PG14/SPI6_MOSI/USART6_TX/OCTOSPIM_P1_IO7/FMC_A25/ETH_RMII_TXD1)
PG15: R22.2 SW3.1 U1.132(PG15/OCTOSPIM_P2_DQS/FMC_NCAS)
RST: FPC1.6
RTC_IN: C9.2 R13.1 X1.2(OSC2)
RTC_OUT: C7.2 R10.1 X1.1(OSC1)
USB_D+: U6.1(UD+) USB2.A6(DP1) USB2.B6(DP2)
USB_D-: U6.2(UD-) USB2.A7(DN1) USB2.B7(DN2)
USB_DN: R3.2 USB1.A7(DN1) USB1.B7(DN2)
USB_DP: R5.2 USB1.A6(DP1) USB1.B6(DP2)
Net-(BT1-1): BT1.1(+) D2.2(A)
Net-(C1-1): C1.1 D1.1(K) D2.1(K) U1.6(VBAT)
Net-(C3-2): C3.2 U1.106(VCAP)
Net-(C6-2): C6.2 U1.71(VCAP)
Net-(C10-2): C10.2 Q1.1 R12.2 R14.2
Net-(C16-1): C16.1 U6.10(V3)
Net-(C17-2): C17.2 D3.1(K) Q2.1
Net-(D3-2): D3.2(A) R12.1 SW1.1
Net-(FPC1-13): FPC1.13 X2.3(OUT)
Net-(LED4-2): LED4.2(A) R24.2
Net-(Q2-3): Q2.3 R15.1
Net-(R4-2): R4.2 USB1.A5(CC1)
Net-(R6-1): R6.1 USB1.B5(CC2)
Net-(R17-2): R17.2 USB2.A5(CC1)
Net-(R18-1): R18.1 USB2.B5(CC2)

Not connected (* = marked no-connect by the designer): FPC1 1* 23* 24* 25* 26*; JTAG1 11* 17* 19*; M1 1*; M2 1*; M3 1*; M4 1*; MARK1 1; MARK2 1; MARK3 1; MARK4 1; MARK5 1; MARK6 1; U6 4(RTS#)* 5(CTS#)* 6(TNOW)*; U9 4(TAB)*; USB1 A8(SBUS1)* B8(SBUS2)*; USB2 A8(SBUS1)* B8(SBUS2)*; X2 1(ENABLE-CONTROL)*

## Notes on the sheets
sheet 1
- 主控
sheet 2
- USB
- 串口
- JTAG
sheet 4
- Flash
- SROM
- 复位和晶振
